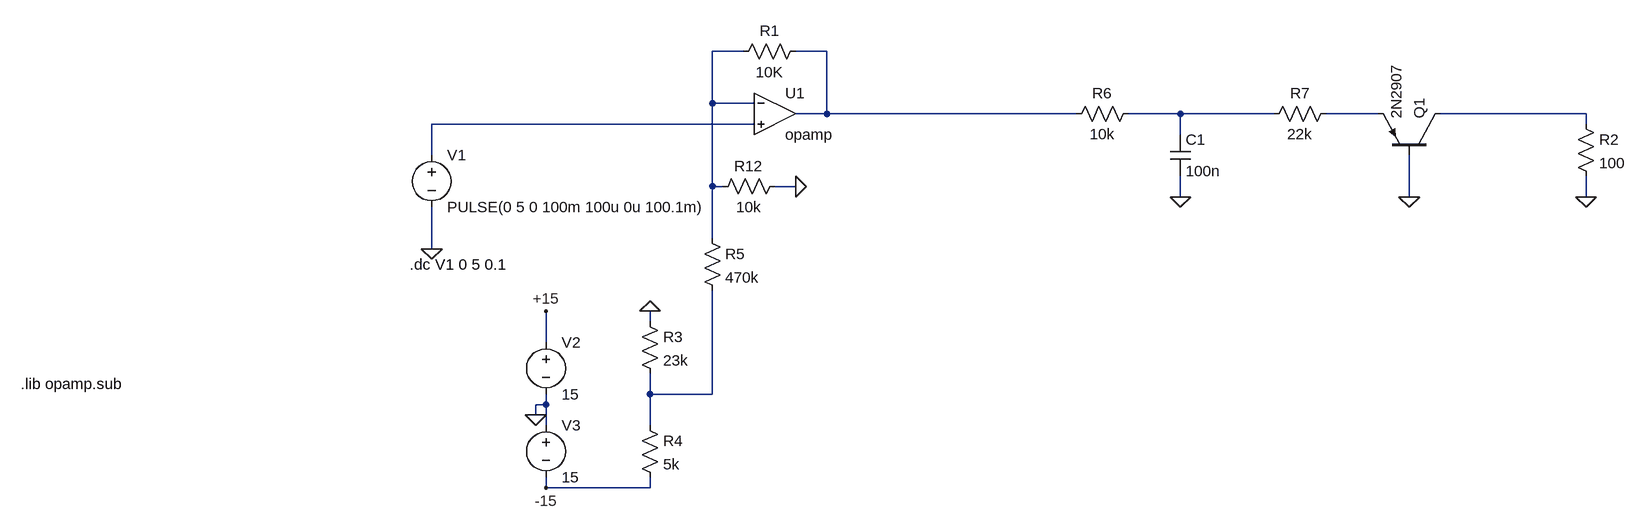
[diagram p0: schematic vca_cont_driver.asc]
vca_cont_driver.asc, the LTspice schematic file:
Version 4
SHEET 1 1920 700
WIRE 512 -16 464 -16
WIRE 640 -16 592 -16
WIRE 464 64 464 -16
WIRE 528 64 464 64
WIRE 640 80 640 -16
WIRE 640 80 592 80
WIRE 1024 80 640 80
WIRE 1184 80 1104 80
WIRE 1328 80 1184 80
WIRE 1488 80 1408 80
WIRE 1808 80 1584 80
WIRE 528 96 32 96
WIRE 1808 96 1808 80
WIRE 1184 112 1184 80
WIRE 32 144 32 96
WIRE 464 192 464 64
WIRE 480 192 464 192
WIRE 592 192 560 192
WIRE 1184 208 1184 176
WIRE 1536 208 1536 144
WIRE 1808 208 1808 176
WIRE 464 272 464 192
WIRE 32 288 32 224
WIRE 368 400 368 384
WIRE 208 432 208 384
WIRE 368 512 368 480
WIRE 464 512 464 352
WIRE 464 512 368 512
WIRE 208 528 208 512
WIRE 208 528 192 528
WIRE 192 544 192 528
WIRE 208 560 208 528
WIRE 368 560 368 512
WIRE 208 656 208 640
WIRE 368 656 368 640
WIRE 368 656 208 656
FLAG 32 288 0
FLAG 192 544 0
FLAG 208 384 +15
FLAG 208 656 -15
FLAG 1184 208 0
FLAG 368 384 0
FLAG 592 192 0
FLAG 1536 208 0
FLAG 1808 208 0
SYMBOL voltage 32 128 R0
WINDOW 123 0 0 Left 0
WINDOW 39 0 0 Left 0
SYMATTR InstName V1
SYMATTR Value PULSE(0 5 0 100m 100u 0u 100.1m)
SYMBOL OpAmps\\opamp 560 16 R0
SYMATTR InstName U1
SYMBOL res 496 0 R270
WINDOW 0 32 56 VTop 2
WINDOW 3 0 56 VBottom 2
SYMATTR InstName R1
SYMATTR Value 10K
SYMBOL voltage 208 416 R0
SYMATTR InstName V2
SYMATTR Value 15
SYMBOL voltage 208 544 R0
SYMATTR InstName V3
SYMATTR Value 15
SYMBOL res 352 384 R0
SYMATTR InstName R3
SYMATTR Value 23k
SYMBOL res 352 544 R0
SYMATTR InstName R4
SYMATTR Value 5k
SYMBOL res 448 256 R0
SYMATTR InstName R5
SYMATTR Value 470k
SYMBOL res 1008 96 R270
WINDOW 0 32 56 VTop 2
WINDOW 3 0 56 VBottom 2
SYMATTR InstName R6
SYMATTR Value 10k
SYMBOL cap 1168 112 R0
SYMATTR InstName C1
SYMATTR Value 100n
SYMBOL res 1312 96 R270
WINDOW 0 32 56 VTop 2
WINDOW 3 0 56 VBottom 2
SYMATTR InstName R7
SYMATTR Value 22k
SYMBOL res 464 208 R270
WINDOW 0 32 56 VTop 2
WINDOW 3 0 56 VBottom 2
SYMATTR InstName R12
SYMATTR Value 10k
SYMBOL pnp 1584 144 M270
SYMATTR InstName Q1
SYMATTR Value 2N2907
SYMBOL res 1792 80 R0
SYMATTR InstName R2
SYMATTR Value 100
TEXT -2 312 Left 2 !.dc V1 0 5 0.1
TEXT -600 496 Left 2 !.lib opamp.sub

The netlist it stands for:
* vca_cont_driver.asc
V1 N006 0 PULSE(0 5 0 100m 100u 0u 100.1m)
XU1 N001 N006 N002 opamp Aol=100K GBW=10Meg  ; pins invin noninvin out
R1 N001 N002 10K
V2 +15 0 15
V3 0 -15 15
R3 0 N007 23k
R4 N007 -15 5k
R5 N001 N007 470k
R6 N002 N003 10k
C1 N003 0 100n
R7 N003 N004 22k
R12 N001 0 10k
Q1 N005 0 N004 0 2N2907
R2 N005 0 100
.model NPN NPN
.model PNP PNP
.lib standard.bjt
.dc V1 0 5 0.1
.lib opamp.sub
.backanno
.end